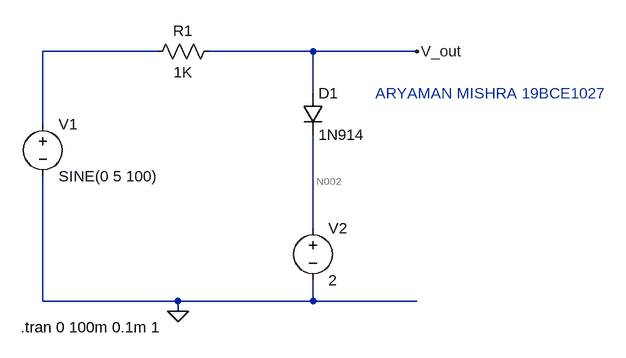
[diagram p0: schematic Draft4.asc]
Draft4.asc, the LTspice schematic file:
Version 4
SHEET 1 988 680
WIRE 288 -16 112 -16
WIRE 528 -16 368 -16
WIRE 688 -16 528 -16
WIRE 528 48 528 -16
WIRE 112 96 112 -16
WIRE 528 256 528 112
WIRE 112 368 112 176
WIRE 320 368 112 368
WIRE 528 368 528 336
WIRE 528 368 320 368
WIRE 688 368 528 368
WIRE 320 384 320 368
FLAG 320 384 0
FLAG 688 -16 V_out
SYMBOL voltage 112 80 R0
WINDOW 123 0 0 Left 0
WINDOW 39 0 0 Left 0
SYMATTR InstName V1
SYMATTR Value SINE(0 5 100)
SYMBOL voltage 528 240 R0
WINDOW 123 0 0 Left 0
WINDOW 39 0 0 Left 0
SYMATTR InstName V2
SYMATTR Value 2
SYMBOL res 384 -32 R90
WINDOW 0 0 56 VBottom 2
WINDOW 3 32 56 VTop 2
SYMATTR InstName R1
SYMATTR Value 1K
SYMBOL diode 512 48 R0
SYMATTR InstName D1
SYMATTR Value 1N914
TEXT 78 408 Left 2 !.tran 0 100m 0.1m 1
TEXT 624 48 Left 2 ;ARYAMAN MISHRA 19BCE1027

The netlist it stands for:
* Draft4.asc
V1 N001 0 SINE(0 5 100)
V2 N002 0 2
R1 V_out N001 1K
D1 V_out N002 1N914
.model D D
.lib standard.dio
.tran 0 100m 0.1m 1
* ARYAMAN MISHRA 19BCE1027
.backanno
.end

* Results of the author's LTspice run, read from the files saved beside the schematic
* Operating Point, zero values left out:
*   V(n002) = 2 V
*   V(v_out) = 2.522 µV
*   I(D1) = -2.522 nA
*   I(R1) = 2.522 nA
*   I(V2) = -2.522 nA
*   I(V1) = 2.522 nA